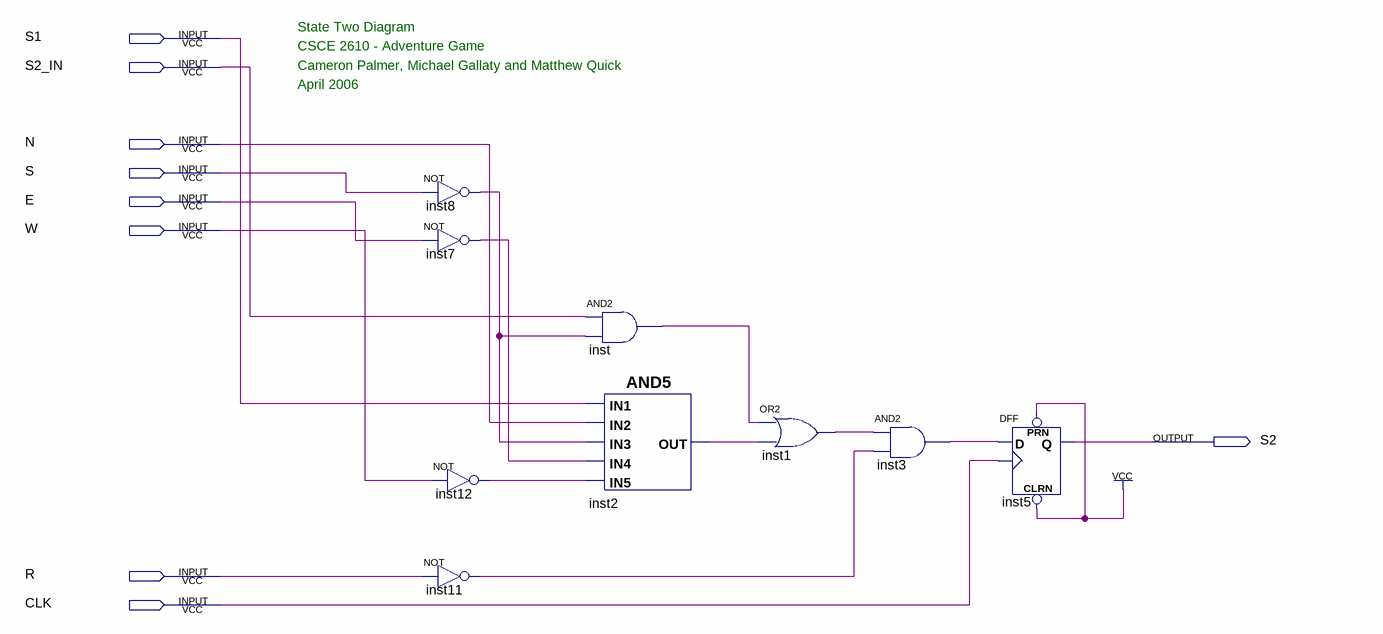
[diagram p0: schematic sheet]
// Quartus schematic state_two.bdf as structural Verilog: 9 symbols, 9 pins
module state_two (
  input  S1,
  input  S2_IN,
  input  N,
  input  S,
  input  E,
  input  W,
  input  R,
  input  CLK,
  output S2
);

  wire inst1_out, inst2_out, inst3_out, inst7_out, inst8_out, inst11_out, inst12_out, inst_out;

  not inst8 (inst8_out, S);
  not inst7 (inst7_out, E);
  not inst12 (inst12_out, W);
  not inst11 (inst11_out, R);
  and inst (inst_out, S2_IN, inst8_out);
  and inst2 (inst2_out, S1, N, inst8_out, inst7_out, inst12_out);
  or inst1 (inst1_out, inst_out, inst2_out);
  and inst3 (inst3_out, inst1_out, inst11_out);
  DFF inst5 (.CLRN(1'b1), .CLK(CLK), .D(inst3_out), .PRN(1'b1), .Q(S2));

  // Notes on the sheet:
  //   State Two Diagram
  //   CSCE 2610 - Adventure Game
  //   Cameron Palmer, Michael Gallaty and Matthew Quick
  //   April 2006
endmodule
